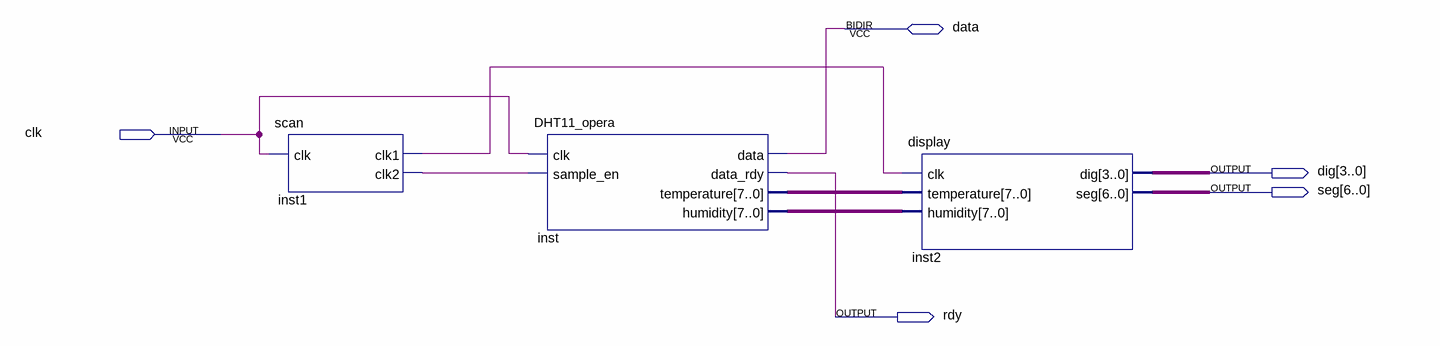
[diagram p0: schematic sheet]
// Quartus schematic wenshi.bdf as structural Verilog: 3 symbols, 5 pins
module wenshi (
  input  clk,
  inout  data,
  output [3:0] dig,
  output [6:0] seg,
  output rdy
);

  wire inst1_clk1, inst1_clk2;
  wire [7:0] inst_humidity, inst_temperature;

  scan inst1 (.clk(clk), .clk1(inst1_clk1), .clk2(inst1_clk2));
  DHT11_opera inst (
    .clk(clk), .sample_en(inst1_clk2), .data_rdy(rdy), .temperature(inst_temperature),
    .humidity(inst_humidity), .data(data));
  display inst2 (.clk(inst1_clk1), .temperature(inst_temperature), .humidity(inst_humidity), .dig(dig), .seg(seg));
endmodule
